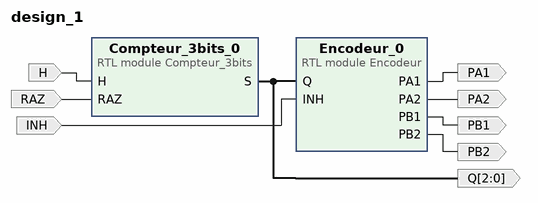
[diagram p0: block diagram of the top level]
# Vivado block design design_1, xc7z020clg484-1, Vivado 2019.1
create_bd_design design_1

create_bd_port -dir I INH
create_bd_port -dir I H
create_bd_port -dir I RAZ
create_bd_port -dir O PA1
create_bd_port -dir O PA2
create_bd_port -dir O PB1
create_bd_port -dir O PB2
create_bd_port -dir O -from 2 -to 0 Q

create_bd_cell -type module -reference Compteur_3bits Compteur_3bits_0
create_bd_cell -type module -reference Encodeur Encodeur_0

# ---- connections ----

connect_bd_net [get_bd_pins Compteur_3bits_0/S] [get_bd_pins Encodeur_0/Q] [get_bd_ports Q]
connect_bd_net [get_bd_ports INH] [get_bd_pins Encodeur_0/INH]
connect_bd_net [get_bd_ports H] [get_bd_pins Compteur_3bits_0/H]
connect_bd_net [get_bd_ports RAZ] [get_bd_pins Compteur_3bits_0/RAZ]
connect_bd_net [get_bd_pins Encodeur_0/PA1] [get_bd_ports PA1]
connect_bd_net [get_bd_pins Encodeur_0/PA2] [get_bd_ports PA2]
connect_bd_net [get_bd_pins Encodeur_0/PB1] [get_bd_ports PB1]
connect_bd_net [get_bd_pins Encodeur_0/PB2] [get_bd_ports PB2]

validate_bd_design
save_bd_design
